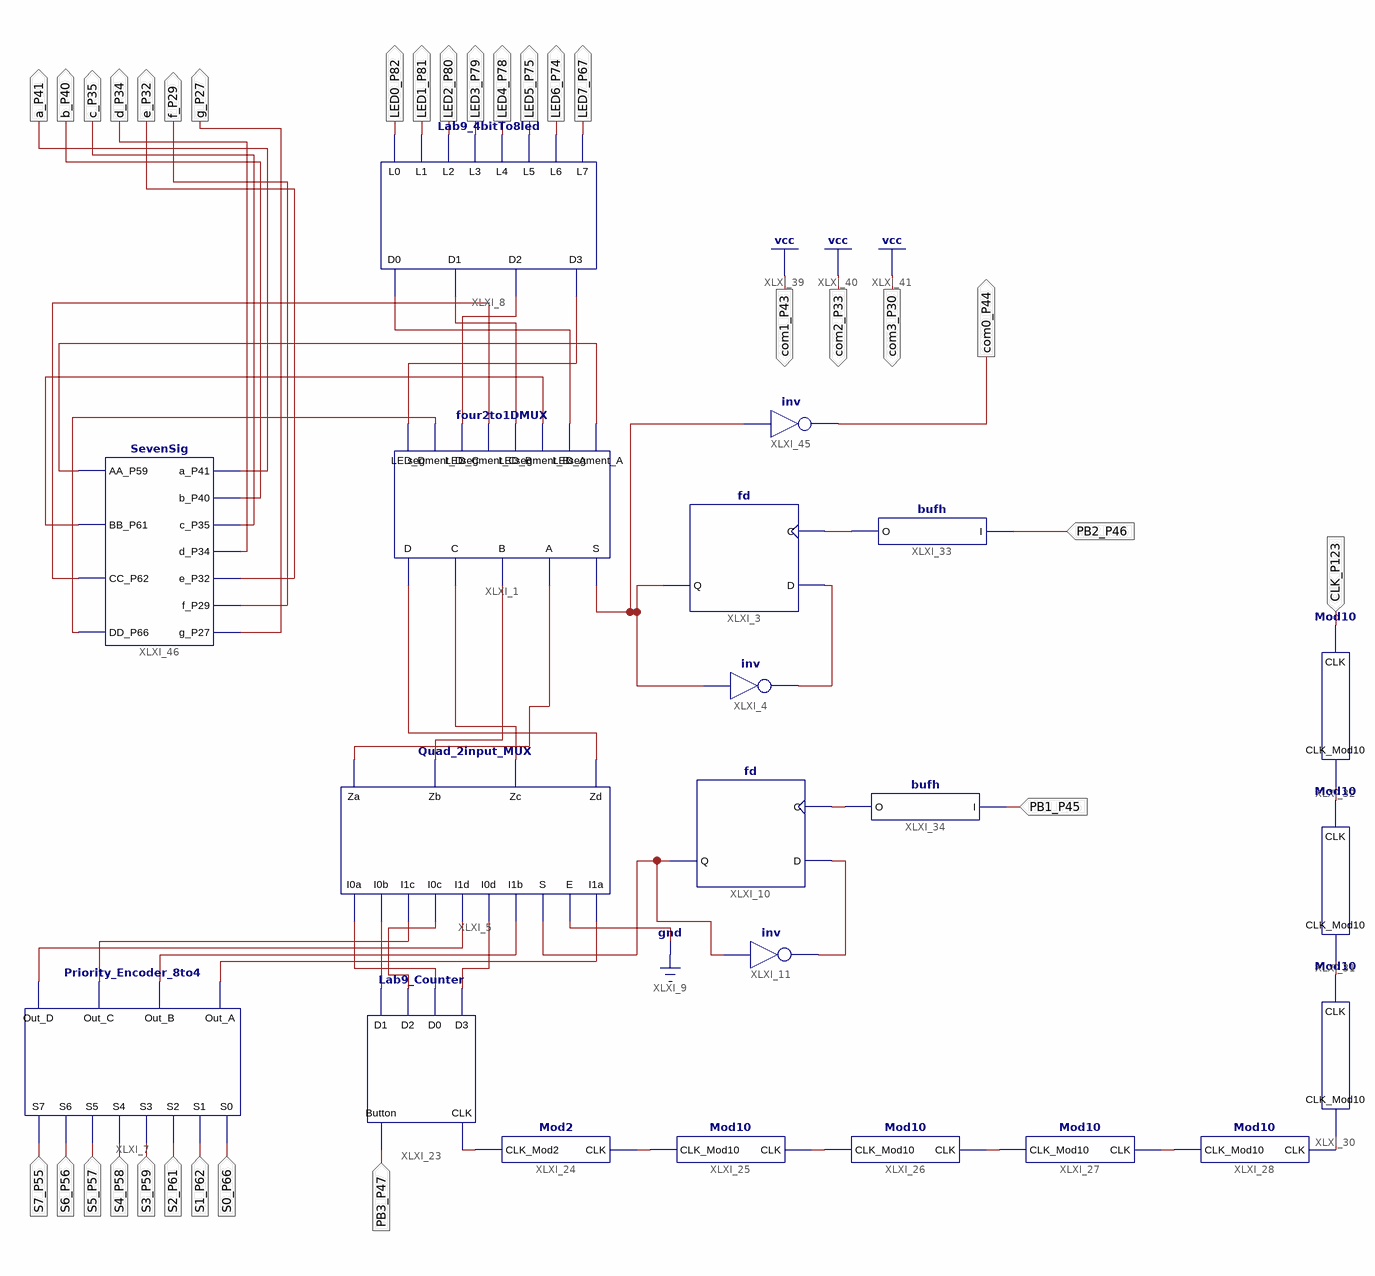
[diagram p0: schematic sheet 1]
// Xilinx ISE schematic main.sch (spartan6) as structural Verilog: 21 symbols, 31 ports
module main (
  input  S7_P55,
  input  S6_P56,
  input  S5_P57,
  input  S4_P58,
  input  S3_P59,
  input  S2_P61,
  input  S1_P62,
  input  S0_P66,
  input  PB3_P47,
  input  CLK_P123,
  input  PB1_P45,
  input  PB2_P46,
  output a_P41,
  output b_P40,
  output c_P35,
  output d_P34,
  output e_P32,
  output f_P29,
  output g_P27,
  output LED0_P82,
  output LED1_P81,
  output LED2_P80,
  output LED3_P79,
  output LED4_P78,
  output LED5_P75,
  output LED6_P74,
  output LED7_P67,
  output com1_P43,
  output com2_P33,
  output com3_P30,
  output com0_P44
);

  wire XLXN_3, XLXN_18, XLXN_19, XLXN_20, XLXN_23, XLXN_24, XLXN_25, XLXN_26, XLXN_27, XLXN_36, XLXN_37,
       XLXN_38, XLXN_39, XLXN_42, XLXN_44, XLXN_102, XLXN_103, XLXN_104, XLXN_105, XLXN_107, XLXN_108,
       XLXN_109, XLXN_110, XLXN_111, XLXN_113, XLXN_114, XLXN_115, XLXN_118, XLXN_119, XLXN_128, XLXN_131,
       XLXN_132, XLXN_133, XLXN_134;

  four2to1DMUX XLXI_1 (
    .D(XLXN_18), .C(XLXN_19), .B(XLXN_20), .A(XLXN_23), .S(XLXN_131), .LED_D(XLXN_39), .segment_D(XLXN_132),
    .LED_C(XLXN_38), .segment_C(XLXN_3), .LED_B(XLXN_37), .segment_B(XLXN_134), .LED_A(XLXN_36),
    .segment_A(XLXN_133));
  fd XLXI_3 (.C(XLXN_118), .D(XLXN_128), .Q(XLXN_131));
  Quad_2input_MUX XLXI_5 (
    .I0a(XLXN_102), .I0b(XLXN_103), .I1c(XLXN_25), .I0c(XLXN_104), .I1d(XLXN_24), .I0d(XLXN_105),
    .I1b(XLXN_26), .S(XLXN_44), .E(1'b0), .I1a(XLXN_27), .Za(XLXN_23), .Zb(XLXN_20), .Zc(XLXN_19),
    .Zd(XLXN_18));
  Priority_Encoder_8to4 XLXI_7 (
    .S7(S7_P55), .S6(S6_P56), .S5(S5_P57), .S4(S4_P58), .S3(S3_P59), .S2(S2_P61), .S1(S1_P62), .S0(S0_P66),
    .Out_D(XLXN_24), .Out_C(XLXN_25), .Out_B(XLXN_26), .Out_A(XLXN_27));
  Lab9_4bitTo8led XLXI_8 (
    .D0(XLXN_36), .D1(XLXN_37), .D2(XLXN_38), .D3(XLXN_39), .L0(LED0_P82), .L1(LED1_P81), .L2(LED2_P80),
    .L3(LED3_P79), .L4(LED4_P78), .L5(LED5_P75), .L6(LED6_P74), .L7(LED7_P67));
  fd XLXI_10 (.C(XLXN_119), .D(XLXN_42), .Q(XLXN_44));
  not XLXI_11 (XLXN_42, XLXN_44);
  Lab9_Counter XLXI_23 (.Button(PB3_P47), .CLK(XLXN_107), .D1(XLXN_103), .D2(XLXN_104), .D0(XLXN_102), .D3(XLXN_105));
  Mod2 XLXI_24 (.CLK(XLXN_108), .CLK_Mod2(XLXN_107));
  Mod10 XLXI_25 (.CLK(XLXN_109), .CLK_Mod10(XLXN_108));
  Mod10 XLXI_26 (.CLK(XLXN_110), .CLK_Mod10(XLXN_109));
  Mod10 XLXI_27 (.CLK(XLXN_111), .CLK_Mod10(XLXN_110));
  Mod10 XLXI_28 (.CLK(XLXN_113), .CLK_Mod10(XLXN_111));
  Mod10 XLXI_30 (.CLK(XLXN_114), .CLK_Mod10(XLXN_113));
  Mod10 XLXI_31 (.CLK(XLXN_115), .CLK_Mod10(XLXN_114));
  Mod10 XLXI_32 (.CLK(CLK_P123), .CLK_Mod10(XLXN_115));
  bufh XLXI_33 (.I(PB2_P46), .O(XLXN_118));
  bufh XLXI_34 (.I(PB1_P45), .O(XLXN_119));
  not XLXI_4 (XLXN_128, XLXN_131);
  not XLXI_45 (com0_P44, XLXN_131);
  SevenSig XLXI_46 (
    .AA_P59(XLXN_133), .BB_P61(XLXN_134), .CC_P62(XLXN_3), .DD_P66(XLXN_132), .a_P41(a_P41), .b_P40(b_P40),
    .c_P35(c_P35), .d_P34(d_P34), .e_P32(e_P32), .f_P29(f_P29), .g_P27(g_P27));

  assign com1_P43 = 1'b1;
  assign com2_P33 = 1'b1;
  assign com3_P30 = 1'b1;
endmodule
